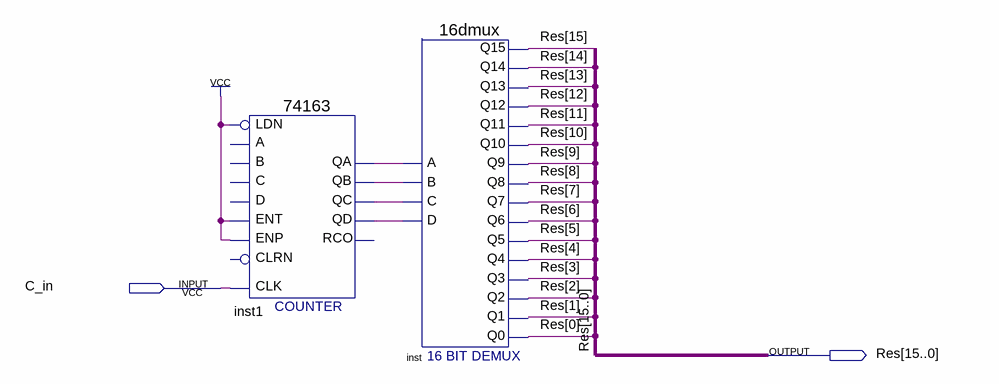
[diagram p0: schematic sheet]
// Quartus schematic DivergentBlock.bdf as structural Verilog: 2 symbols, 2 pins
module DivergentBlock (
  input  C_in,
  output [15:0] Res
);

  wire inst1_qa, inst1_qb, inst1_qc, inst1_qd;

  \74163  inst1 (
    .ENT(1'b1), .CLK(C_in), .ENP(1'b1), .LDN(1'b1), .QA(inst1_qa), .QB(inst1_qb), .QC(inst1_qc), .QD(inst1_qd));  // open: C, B, A, D, CLRN, RCO
  \16dmux  inst (
    .C(inst1_qc), .B(inst1_qb), .A(inst1_qa), .D(inst1_qd), .Q12(Res[12]), .Q13(Res[13]), .Q11(Res[11]),
    .Q9(Res[9]), .Q10(Res[10]), .Q7(Res[7]), .Q8(Res[8]), .Q4(Res[4]), .Q5(Res[5]), .Q6(Res[6]), .Q2(Res[2]),
    .Q3(Res[3]), .Q14(Res[14]), .Q15(Res[15]), .Q0(Res[0]), .Q1(Res[1]));
endmodule
